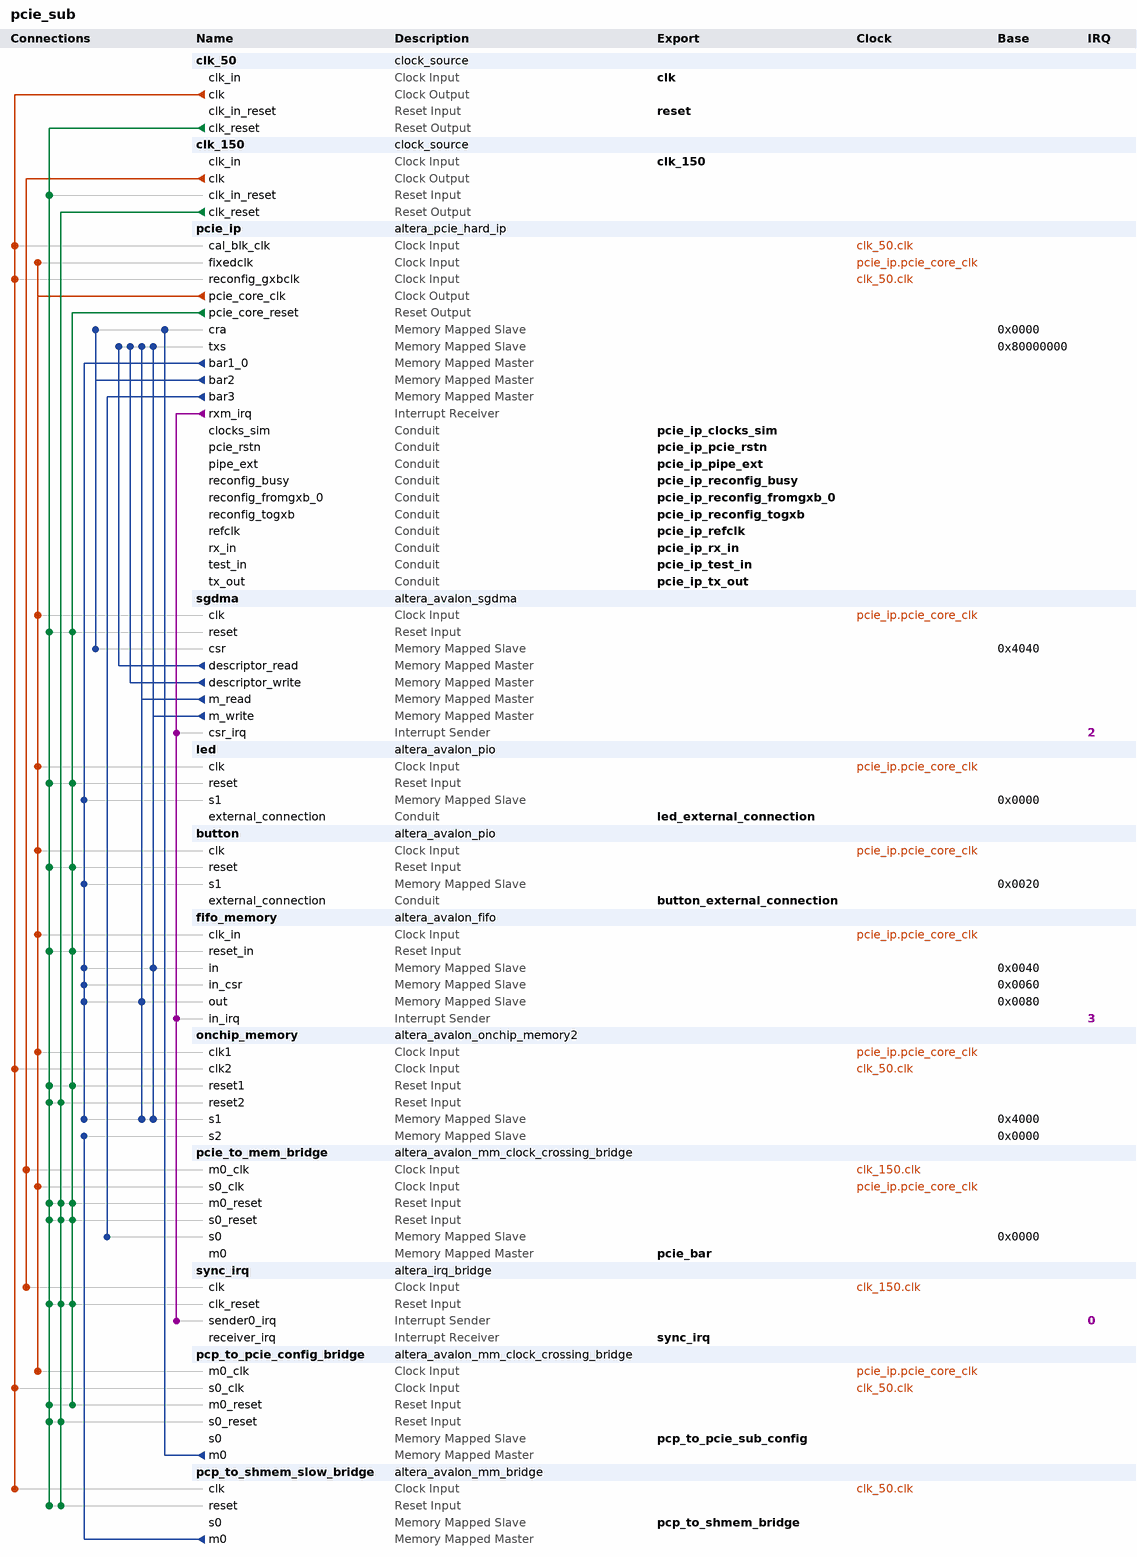
[diagram p0: system contents]
# Platform Designer (Qsys) system pcie_sub, Cyclone IV GX EP4CGX150DF31C7
# Parameters at their usual value, and those the tool derives, are not listed.
package require -exact qsys 14.0
create_system pcie_sub
set_project_property DEVICE_FAMILY {Cyclone IV GX}
set_project_property DEVICE EP4CGX150DF31C7

add_instance clk_50 clock_source 14.0
set_instance_parameter_value clk_50 clockFrequency 50000000

add_instance clk_150 clock_source 14.0
set_instance_parameter_value clk_150 clockFrequency 150000000

add_instance pcie_ip altera_pcie_hard_ip 14.0
set_instance_parameter_value pcie_ip p_pcie_test_out_width None
set_instance_parameter_value pcie_ip {BAR Type} {64 bit Prefetchable,Not used,32 bit Non-Prefetchable,32 bit Non-Prefetchable,Not used,Not used}
set_instance_parameter_value pcie_ip vendor_id 4466
set_instance_parameter_value pcie_ip device_id 57345
set_instance_parameter_value pcie_ip class_code 0
set_instance_parameter_value pcie_ip subsystem_vendor_id 4466
set_instance_parameter_value pcie_ip subsystem_device_id 4
set_instance_parameter_value pcie_ip my_advanced_errors false
set_instance_parameter_value pcie_ip my_enable_ecrc_check false
set_instance_parameter_value pcie_ip my_enable_ecrc_gen false
set_instance_parameter_value pcie_ip CG_NO_CPL_REORDERING 0
set_instance_parameter_value pcie_ip CG_ENABLE_A2P_INTERRUPT 0
set_instance_parameter_value pcie_ip p_user_msi_enable 0
set_instance_parameter_value pcie_ip CB_A2P_ADDR_MAP_PASS_THRU_BITS 31
set_instance_parameter_value pcie_ip {PCIe Address 63:32} 0x00000000,0x00000000,0x00000000,0x00000000,0x00000000,0x00000000,0x00000000,0x00000000,0x00000000,0x00000000,0x00000000,0x00000000,0x00000000,0x00000000,0x00000000,0x00000000
set_instance_parameter_value pcie_ip {PCIe Address 31:0} 0x00000000,0x00000000,0x00000000,0x00000000,0x00000000,0x00000000,0x00000000,0x00000000,0x00000000,0x00000000,0x00000000,0x00000000,0x00000000,0x00000000,0x00000000,0x00000000

add_instance sgdma altera_avalon_sgdma 14.0
set_instance_parameter_value sgdma enableBurstTransfers false
set_instance_parameter_value sgdma enableUnalignedTransfers false
set_instance_parameter_value sgdma readBlockDataWidth 64
set_instance_parameter_value sgdma sinkErrorWidth 0
set_instance_parameter_value sgdma sourceErrorWidth 0
set_instance_parameter_value sgdma transferMode MEMORY_TO_MEMORY
set_instance_parameter_value sgdma writeBurstcountWidth 4

add_instance led altera_avalon_pio 14.0
set_instance_parameter_value led direction Output
set_instance_parameter_value led width 21

add_instance button altera_avalon_pio 14.0
set_instance_parameter_value button captureEdge true
set_instance_parameter_value button direction Input
set_instance_parameter_value button edgeType FALLING
set_instance_parameter_value button irqType EDGE
set_instance_parameter_value button width 4

add_instance fifo_memory altera_avalon_fifo 14.0
set_instance_parameter_value fifo_memory avalonMMAvalonMMDataWidth 64
set_instance_parameter_value fifo_memory bitsPerSymbol 16
set_instance_parameter_value fifo_memory channelWidth 8
set_instance_parameter_value fifo_memory errorWidth 8
set_instance_parameter_value fifo_memory fifoDepth 2048
set_instance_parameter_value fifo_memory fifoInputInterfaceOptions AVALONMM_WRITE
set_instance_parameter_value fifo_memory fifoOutputInterfaceOptions AVALONMM_READ
set_instance_parameter_value fifo_memory singleClockMode true
set_instance_parameter_value fifo_memory symbolsPerBeat 2
set_instance_parameter_value fifo_memory useIRQ true
set_instance_parameter_value fifo_memory usePacket true
set_instance_parameter_value fifo_memory useReadControl false

add_instance onchip_memory altera_avalon_onchip_memory2 14.0
set_instance_parameter_value onchip_memory dataWidth 32
set_instance_parameter_value onchip_memory dualPort true
set_instance_parameter_value onchip_memory initMemContent true
set_instance_parameter_value onchip_memory initializationFileName onchip_memory
set_instance_parameter_value onchip_memory memorySize 8092

add_instance pcie_to_mem_bridge altera_avalon_mm_clock_crossing_bridge 14.0
set_instance_parameter_value pcie_to_mem_bridge DATA_WIDTH 32
set_instance_parameter_value pcie_to_mem_bridge ADDRESS_WIDTH 28
set_instance_parameter_value pcie_to_mem_bridge USE_AUTO_ADDRESS_WIDTH 0
set_instance_parameter_value pcie_to_mem_bridge MAX_BURST_SIZE 1
set_instance_parameter_value pcie_to_mem_bridge COMMAND_FIFO_DEPTH 4
set_instance_parameter_value pcie_to_mem_bridge RESPONSE_FIFO_DEPTH 4
set_instance_parameter_value pcie_to_mem_bridge MASTER_SYNC_DEPTH 2
set_instance_parameter_value pcie_to_mem_bridge SLAVE_SYNC_DEPTH 2

add_instance sync_irq altera_irq_bridge 14.0
set_instance_parameter_value sync_irq IRQ_WIDTH 1

add_instance pcp_to_pcie_config_bridge altera_avalon_mm_clock_crossing_bridge 14.0
set_instance_parameter_value pcp_to_pcie_config_bridge DATA_WIDTH 32
set_instance_parameter_value pcp_to_pcie_config_bridge ADDRESS_WIDTH 14
set_instance_parameter_value pcp_to_pcie_config_bridge USE_AUTO_ADDRESS_WIDTH 0
set_instance_parameter_value pcp_to_pcie_config_bridge MAX_BURST_SIZE 1
set_instance_parameter_value pcp_to_pcie_config_bridge COMMAND_FIFO_DEPTH 4
set_instance_parameter_value pcp_to_pcie_config_bridge RESPONSE_FIFO_DEPTH 4
set_instance_parameter_value pcp_to_pcie_config_bridge MASTER_SYNC_DEPTH 2
set_instance_parameter_value pcp_to_pcie_config_bridge SLAVE_SYNC_DEPTH 2

add_instance pcp_to_shmem_slow_bridge altera_avalon_mm_bridge 14.0
set_instance_parameter_value pcp_to_shmem_slow_bridge DATA_WIDTH 32
set_instance_parameter_value pcp_to_shmem_slow_bridge ADDRESS_WIDTH 13
set_instance_parameter_value pcp_to_shmem_slow_bridge USE_AUTO_ADDRESS_WIDTH 0
set_instance_parameter_value pcp_to_shmem_slow_bridge ADDRESS_UNITS SYMBOLS
set_instance_parameter_value pcp_to_shmem_slow_bridge MAX_PENDING_RESPONSES 4
set_instance_parameter_value pcp_to_shmem_slow_bridge PIPELINE_COMMAND 0
set_instance_parameter_value pcp_to_shmem_slow_bridge PIPELINE_RESPONSE 0

# connections
add_connection clk_50.clk onchip_memory.clk2 clock
add_connection clk_50.clk pcie_ip.cal_blk_clk clock
add_connection clk_50.clk pcie_ip.reconfig_gxbclk clock
add_connection clk_50.clk pcp_to_pcie_config_bridge.s0_clk clock
add_connection clk_50.clk pcp_to_shmem_slow_bridge.clk clock
add_connection clk_150.clk pcie_to_mem_bridge.m0_clk clock
add_connection clk_150.clk sync_irq.clk clock
add_connection pcie_ip.pcie_core_clk button.clk clock
add_connection pcie_ip.pcie_core_clk fifo_memory.clk_in clock
add_connection pcie_ip.pcie_core_clk led.clk clock
add_connection pcie_ip.pcie_core_clk onchip_memory.clk1 clock
add_connection pcie_ip.pcie_core_clk pcie_ip.fixedclk clock
add_connection pcie_ip.pcie_core_clk pcie_to_mem_bridge.s0_clk clock
add_connection pcie_ip.pcie_core_clk pcp_to_pcie_config_bridge.m0_clk clock
add_connection pcie_ip.pcie_core_clk sgdma.clk clock
add_connection clk_50.clk_reset button.reset reset
add_connection clk_50.clk_reset clk_150.clk_in_reset reset
add_connection clk_50.clk_reset fifo_memory.reset_in reset
add_connection clk_50.clk_reset led.reset reset
add_connection clk_50.clk_reset onchip_memory.reset1 reset
add_connection clk_50.clk_reset onchip_memory.reset2 reset
add_connection clk_50.clk_reset pcie_to_mem_bridge.m0_reset reset
add_connection clk_50.clk_reset pcie_to_mem_bridge.s0_reset reset
add_connection clk_50.clk_reset pcp_to_pcie_config_bridge.m0_reset reset
add_connection clk_50.clk_reset pcp_to_pcie_config_bridge.s0_reset reset
add_connection clk_50.clk_reset pcp_to_shmem_slow_bridge.reset reset
add_connection clk_50.clk_reset sgdma.reset reset
add_connection clk_50.clk_reset sync_irq.clk_reset reset
add_connection clk_150.clk_reset onchip_memory.reset2 reset
add_connection clk_150.clk_reset pcie_to_mem_bridge.m0_reset reset
add_connection clk_150.clk_reset pcie_to_mem_bridge.s0_reset reset
add_connection clk_150.clk_reset pcp_to_pcie_config_bridge.s0_reset reset
add_connection clk_150.clk_reset pcp_to_shmem_slow_bridge.reset reset
add_connection clk_150.clk_reset sync_irq.clk_reset reset
add_connection pcie_ip.pcie_core_reset button.reset reset
add_connection pcie_ip.pcie_core_reset fifo_memory.reset_in reset
add_connection pcie_ip.pcie_core_reset led.reset reset
add_connection pcie_ip.pcie_core_reset onchip_memory.reset1 reset
add_connection pcie_ip.pcie_core_reset pcie_to_mem_bridge.m0_reset reset
add_connection pcie_ip.pcie_core_reset pcie_to_mem_bridge.s0_reset reset
add_connection pcie_ip.pcie_core_reset pcp_to_pcie_config_bridge.m0_reset reset
add_connection pcie_ip.pcie_core_reset sgdma.reset reset
add_connection pcie_ip.pcie_core_reset sync_irq.clk_reset reset
add_connection pcie_ip.bar1_0 button.s1 avalon
set_connection_parameter_value pcie_ip.bar1_0/button.s1 baseAddress 0x0020
add_connection pcie_ip.bar1_0 fifo_memory.in avalon
set_connection_parameter_value pcie_ip.bar1_0/fifo_memory.in baseAddress 0x0040
add_connection pcie_ip.bar1_0 fifo_memory.in_csr avalon
set_connection_parameter_value pcie_ip.bar1_0/fifo_memory.in_csr baseAddress 0x0060
add_connection pcie_ip.bar1_0 fifo_memory.out avalon
set_connection_parameter_value pcie_ip.bar1_0/fifo_memory.out baseAddress 0x0080
add_connection pcie_ip.bar1_0 led.s1 avalon
set_connection_parameter_value pcie_ip.bar1_0/led.s1 baseAddress 0x0000
add_connection pcie_ip.bar1_0 onchip_memory.s1 avalon
set_connection_parameter_value pcie_ip.bar1_0/onchip_memory.s1 baseAddress 0x4000
add_connection pcie_ip.bar2 pcie_ip.cra avalon
set_connection_parameter_value pcie_ip.bar2/pcie_ip.cra baseAddress 0x0000
add_connection pcie_ip.bar2 sgdma.csr avalon
set_connection_parameter_value pcie_ip.bar2/sgdma.csr baseAddress 0x4040
add_connection pcie_ip.bar3 pcie_to_mem_bridge.s0 avalon
set_connection_parameter_value pcie_ip.bar3/pcie_to_mem_bridge.s0 baseAddress 0x0000
add_connection pcp_to_pcie_config_bridge.m0 pcie_ip.cra avalon
set_connection_parameter_value pcp_to_pcie_config_bridge.m0/pcie_ip.cra baseAddress 0x0000
add_connection pcp_to_shmem_slow_bridge.m0 onchip_memory.s2 avalon
set_connection_parameter_value pcp_to_shmem_slow_bridge.m0/onchip_memory.s2 baseAddress 0x0000
add_connection sgdma.descriptor_read pcie_ip.txs avalon
set_connection_parameter_value sgdma.descriptor_read/pcie_ip.txs baseAddress 0x80000000
add_connection sgdma.descriptor_write pcie_ip.txs avalon
set_connection_parameter_value sgdma.descriptor_write/pcie_ip.txs baseAddress 0x80000000
add_connection sgdma.m_read fifo_memory.out avalon
set_connection_parameter_value sgdma.m_read/fifo_memory.out baseAddress 0x0080
add_connection sgdma.m_read onchip_memory.s1 avalon
set_connection_parameter_value sgdma.m_read/onchip_memory.s1 baseAddress 0x4000
add_connection sgdma.m_read pcie_ip.txs avalon
set_connection_parameter_value sgdma.m_read/pcie_ip.txs baseAddress 0x80000000
add_connection sgdma.m_write fifo_memory.in avalon
set_connection_parameter_value sgdma.m_write/fifo_memory.in baseAddress 0x0040
add_connection sgdma.m_write onchip_memory.s1 avalon
set_connection_parameter_value sgdma.m_write/onchip_memory.s1 baseAddress 0x4000
add_connection sgdma.m_write pcie_ip.txs avalon
set_connection_parameter_value sgdma.m_write/pcie_ip.txs baseAddress 0x80000000
add_connection pcie_ip.rxm_irq fifo_memory.in_irq interrupt
set_connection_parameter_value pcie_ip.rxm_irq/fifo_memory.in_irq irqNumber 3
add_connection pcie_ip.rxm_irq sgdma.csr_irq interrupt
set_connection_parameter_value pcie_ip.rxm_irq/sgdma.csr_irq irqNumber 2
add_connection pcie_ip.rxm_irq sync_irq.sender0_irq interrupt
set_connection_parameter_value pcie_ip.rxm_irq/sync_irq.sender0_irq irqNumber 0

# exported interfaces
add_interface clk clock sink
set_interface_property clk EXPORT_OF clk_50.clk_in
add_interface reset reset sink
set_interface_property reset EXPORT_OF clk_50.clk_in_reset
add_interface pcie_ip_reconfig_togxb conduit end
set_interface_property pcie_ip_reconfig_togxb EXPORT_OF pcie_ip.reconfig_togxb
add_interface pcie_ip_refclk conduit end
set_interface_property pcie_ip_refclk EXPORT_OF pcie_ip.refclk
add_interface pcie_ip_test_in conduit end
set_interface_property pcie_ip_test_in EXPORT_OF pcie_ip.test_in
add_interface pcie_ip_pcie_rstn conduit end
set_interface_property pcie_ip_pcie_rstn EXPORT_OF pcie_ip.pcie_rstn
add_interface pcie_ip_clocks_sim conduit end
set_interface_property pcie_ip_clocks_sim EXPORT_OF pcie_ip.clocks_sim
add_interface pcie_ip_reconfig_busy conduit end
set_interface_property pcie_ip_reconfig_busy EXPORT_OF pcie_ip.reconfig_busy
add_interface pcie_ip_pipe_ext conduit end
set_interface_property pcie_ip_pipe_ext EXPORT_OF pcie_ip.pipe_ext
add_interface pcie_ip_rx_in conduit end
set_interface_property pcie_ip_rx_in EXPORT_OF pcie_ip.rx_in
add_interface pcie_ip_tx_out conduit end
set_interface_property pcie_ip_tx_out EXPORT_OF pcie_ip.tx_out
add_interface pcie_ip_reconfig_fromgxb_0 conduit end
set_interface_property pcie_ip_reconfig_fromgxb_0 EXPORT_OF pcie_ip.reconfig_fromgxb_0
add_interface led_external_connection conduit end
set_interface_property led_external_connection EXPORT_OF led.external_connection
add_interface button_external_connection conduit end
set_interface_property button_external_connection EXPORT_OF button.external_connection
add_interface clk_150 clock sink
set_interface_property clk_150 EXPORT_OF clk_150.clk_in
add_interface pcie_bar avalon master
set_interface_property pcie_bar EXPORT_OF pcie_to_mem_bridge.m0
add_interface sync_irq interrupt receiver
set_interface_property sync_irq EXPORT_OF sync_irq.receiver_irq
add_interface pcp_to_shmem_bridge avalon slave
set_interface_property pcp_to_shmem_bridge EXPORT_OF pcp_to_shmem_slow_bridge.s0
add_interface pcp_to_pcie_sub_config avalon slave
set_interface_property pcp_to_pcie_sub_config EXPORT_OF pcp_to_pcie_config_bridge.s0

set_interconnect_requirement {$system} qsys_mm.clockCrossingAdapter HANDSHAKE
set_interconnect_requirement {$system} qsys_mm.maxAdditionalLatency 1

save_system pcie_sub.qsys
